# EAGLE design siggen (EAGLE 5.10)
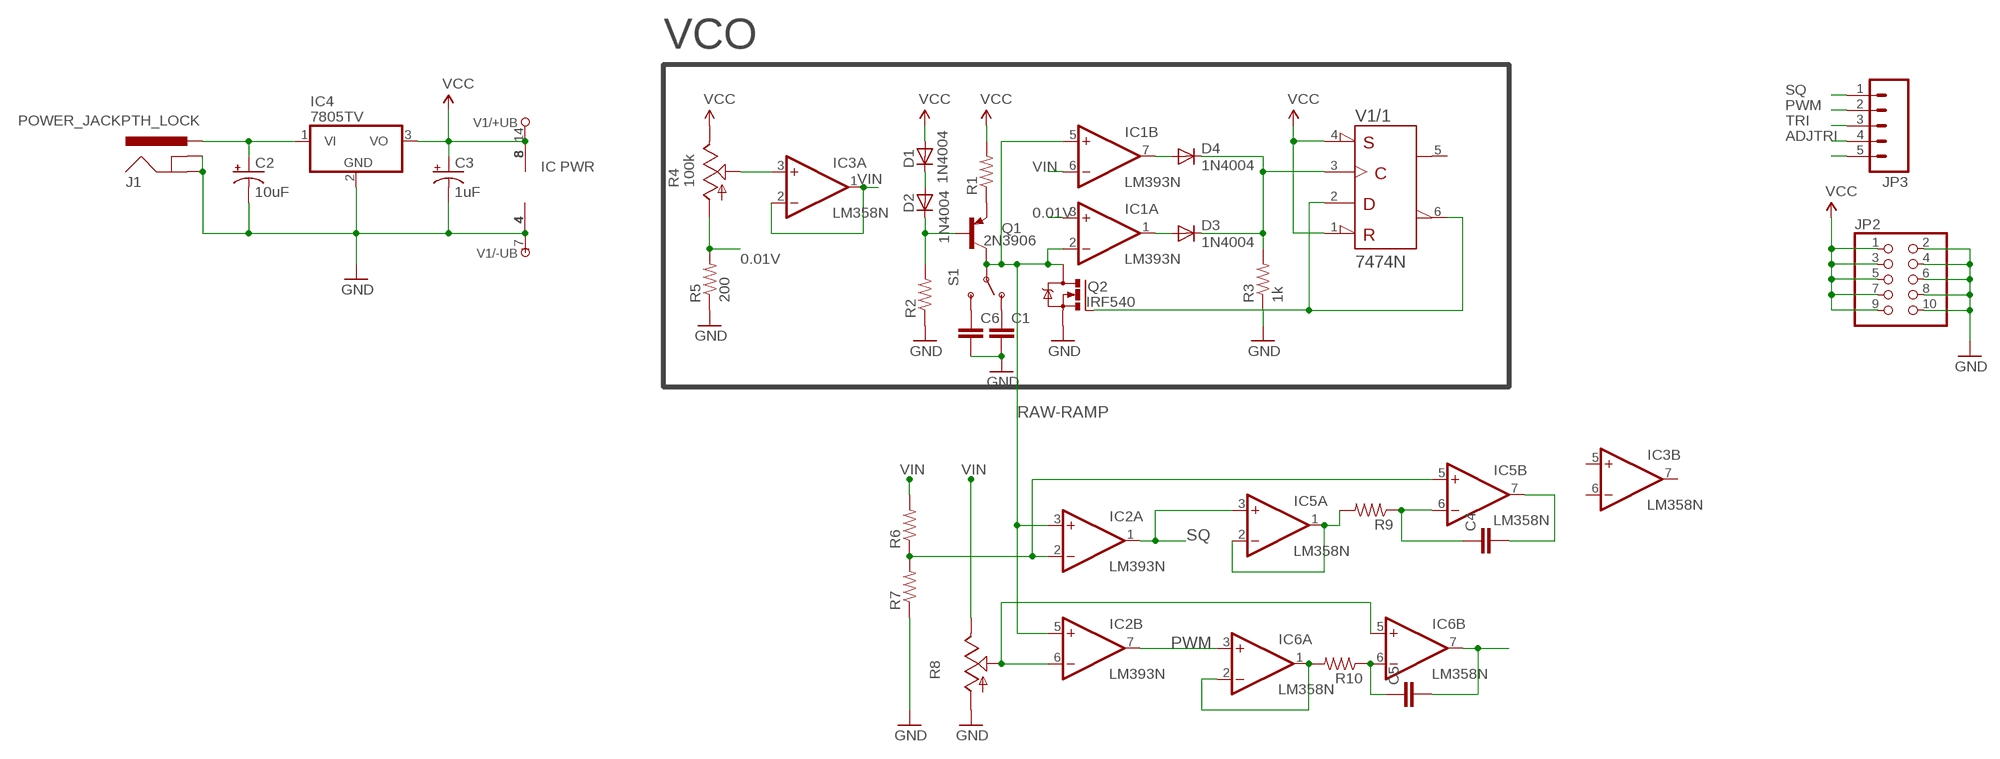
[diagram p0: schematic, sheet 1]

## Parts
C1  C5/3  [C5B3]
C2  10uF  CAP_POLPTH2  [CPOL-RADIAL-10UF-25V]
C3  1uF  CAP_POLPTH2  [CPOL-RADIAL-10UF-25V]
C4  C5/3  [C5B3]
C5  C5/3  [C5B3]
C6  C5/3  [C5B3]
D1  1N4004  [DO41-10]
D2  1N4004  [DO41-10]
D3  1N4004  [DO41-10]
D4  1N4004  [DO41-10]
IC1  LM393N  [DIL08]
IC2  LM393N  [DIL08]
IC3  LM358N  [DIL08]
IC4  7805TV  [TO220V]
IC5  LM358N  [DIL08]
IC6  LM358N  [DIL08]
J1  POWER_JACKPTH_LOCK  [POWER_JACK_PTH_LOCK]
JP2  PINHD-2X5  [2X05]
JP3  M05PTH  [1X05]
Q1  2N3906  [TO92]
Q2  IRF540  [TO220BV]
R1  R-US_0207/7  [0207/7]
R2  R-US_0207/7  [0207/7]
R3  1k  R-US_0207/7  [0207/7]
R4  100k  TRIM_US-B25V  [B25V]
R5  200  R-US_0207/7  [0207/7]
R6  R-US_0207/7  [0207/7]
R7  R-US_0207/7  [0207/7]
R8  TRIM_US-B25V  [B25V]
R9  R-US_0207/7  [0207/7]
R10  R-US_0207/7  [0207/7]
S1  SWITCH-SPSTPTH  [SWITCH-SPDT]
V1  7474N  [DIL14]

## Nets
0.01V: IC1.3(A:+IN) R4.A R5.2
ADJTRI: C5.2 IC6.7(B:OUT) JP3.4
GND: C1.2 C2.2(-) C3.2(-) C6.2 IC1.4(P:V-) IC2.4(P:V-) IC3.4(P:V-) IC4.2(GND) IC5.4(P:V-) IC6.4(P:V-) J1.GND J1.GNDBREAK JP2.2 JP2.4 JP2.6 JP2.8 JP2.10 Q2.S R2.1 R3.1 R5.1 R7.1 R8.A V1.7(/-UB:-UB)
N$1: D1.C D2.A
N$2: D2.C Q1.2(B) R2.2
N$3: Q1.3(E) R1.1
N$4: IC2.2(A:-IN) IC5.5(B:+IN) R6.1 R7.2
N$5: D4.A IC1.7(B:OUT)
N$6: D3.A IC1.1(A:OUT)
N$7: D3.C D4.C R3.2 V1.3(/1:CLK)
N$8: IC3.3(A:+IN) R4.S
N$9: C2.1(+) IC4.1(VI) J1.PWR
N$10: IC2.6(B:-IN) IC6.5(B:+IN) R8.S
N$11: Q2.G V1.2(/1:D) V1.6(/1:!Q)
N$12: C4.1 IC5.6(B:-IN) R9.1
N$14: IC5.1(A:OUT) IC5.2(A:-IN) R9.2
N$15: IC6.1(A:OUT) IC6.2(A:-IN) R10.2
N$16: C5.1 IC6.6(B:-IN) R10.1
N$17: C6.1 S1.3(S)
N$18: C1.1 S1.1(O)
N$21: JP3.5
PWM: IC2.7(B:OUT) IC6.3(A:+IN) JP3.2
RAW-RAMP: IC1.2(A:-IN) IC1.5(B:+IN) IC2.3(A:+IN) IC2.5(B:+IN) Q1.1(C) Q2.D S1.2(P)
SQ: IC2.1(A:OUT) IC5.3(A:+IN) JP3.1
TRI: C4.2 IC5.7(B:OUT) JP3.3
VCC: C3.1(+) D1.A IC1.8(P:V+) IC2.8(P:V+) IC3.8(P:V+) IC4.3(VO) IC5.8(P:V+) IC6.8(P:V+) JP2.1 JP2.3 JP2.5 JP2.7 JP2.9 R1.2 R4.E V1.1(/1:!CLR) V1.4(/1:!PRE) V1.14(/+UB:+UB)
VIN: IC1.6(B:-IN) IC3.1(A:OUT) IC3.2(A:-IN) R6.2 R8.E
Unconnected: IC3.5(B:+IN) IC3.6(B:-IN) IC3.7(B:OUT) V1.5(/1:Q) V1.8(/2:!Q) V1.9(/2:Q) V1.10(/2:!PRE) V1.11(/2:CLK) V1.12(/2:D) V1.13(/2:!CLR)

## Notes on the sheet
- VCO
- IC PWR

## Library data of the parts
C1 C4-C6 = capacitor-wima:C: CAPACITOR naming: grid - package width
C2 C3 = SparkFun:CAP_POL: Capacitor Polarized These are standard SMD and PTH capacitors. Normally 10uF, 47uF, and 100uF in electrolytic and tantalum varieties. Always verify the external diameter of the through hole cap, it varies with capacity, voltage, and manufacturer. The EIA devices should be standard.
D1-D4 = diode:1N4004: DIODE general purpose rectifier, 1 A
IC1 IC2 = linear:LM393: COMPARATOR
IC3 IC5 IC6 = linear:LM358: OP AMP also LM158; LM258; LM2904 Source: http://cache.national.com/ds/LM/LM158.pdf
IC4 = linear:78*: Positive VOLTAGE REGULATOR Source: http://cache.national.com/ds/LM/LM78L05.pdf http://www.fairchildsemi.com/ds/LM/LM7805.pdf
J1 = SparkFun:POWER_JACK: Power Jack This is the standard 5.5mm barrel jack for power. The PTH is the most common, proven, reliable, footprint. All others are experimental. The Slot footprint only works if the mill layer is transmitted to the PCB fab house so be warned. Spark Fun Electronics SKU : PRT-00119. Mating wall wart : TOL-00298 (and others)
JP2 = pinhead:PINHD-2X5: PIN HEADER
JP3 = SparkFun:M05: Header 5 Standard 5-pin 0.1" header. Use with straight break away headers (SKU : PRT-00116), right angle break away headers (PRT-00553), swiss pins (PRT-00743), machine pins (PRT-00117), and female headers (PRT-00115). Molex polarized connector foot print use with SKU : PRT-08230 with associated crimp pins and housings.
Q1 = transistor-pnp:2N3906: PNP Transistor
Q2 = transistor-power:IRF540: HEXFET Power MOSFET
R1-R3 R5-R7 R9 R10 = rcl:R-US_: RESISTOR, American symbol
R4 R8 = pot:TRIM_US-: POTENTIOMETER
S1 = SparkFun:SWITCH-SPST: SPST Switch Simple slide switch. Spark Fun Electronics SKU : COM-00102
V1 = 74ttl-din:74*74: Dual D type positive edge triggered FLIP FLOP, preset and clear

## Board
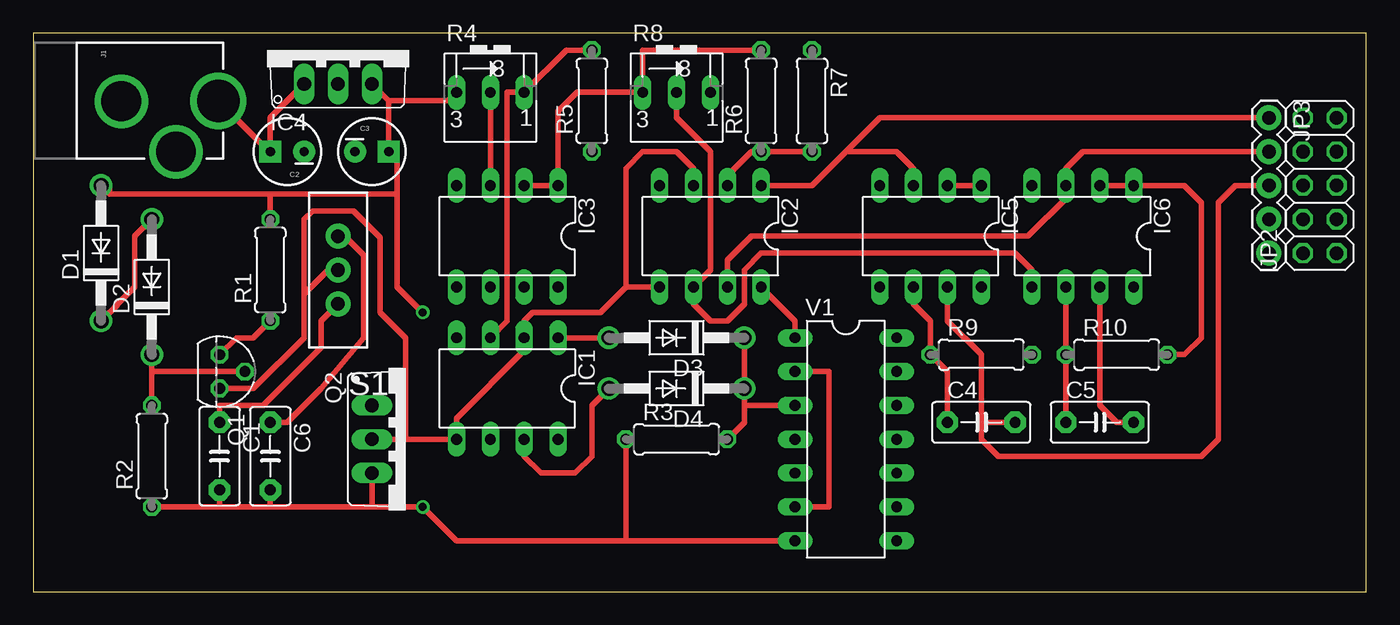
[diagram p1: board, top side]
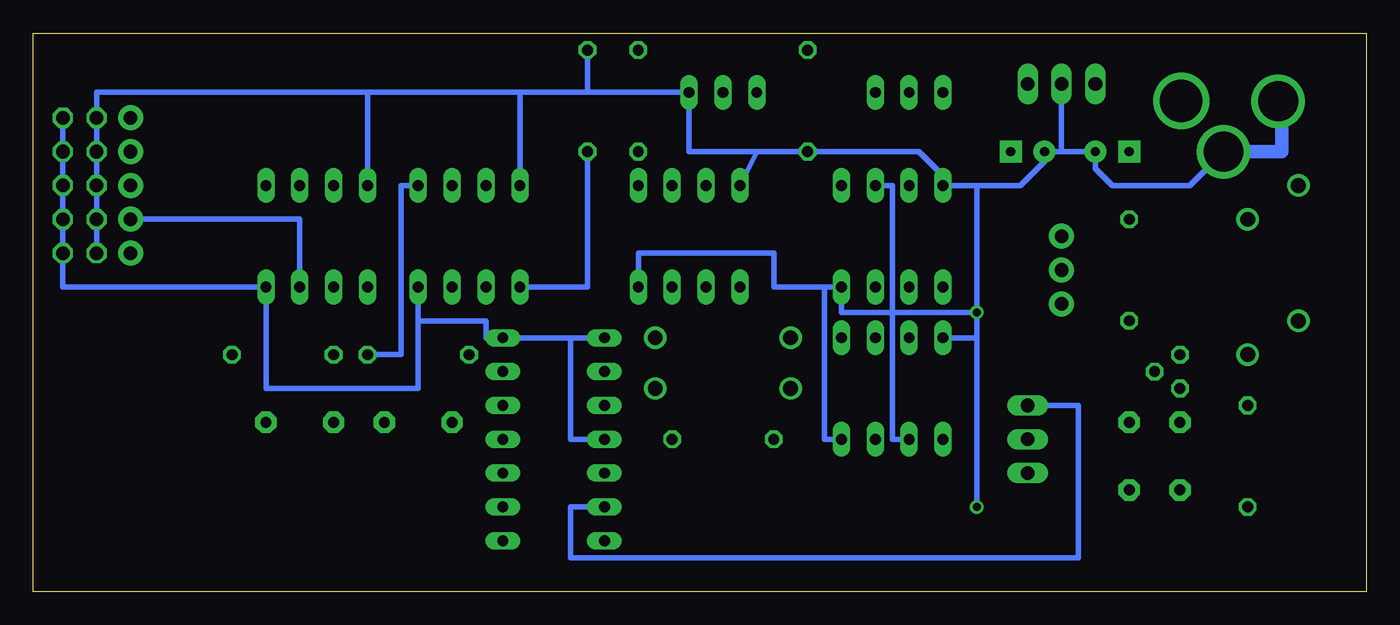
[diagram p2: board, bottom side, seen from below]

Size 100 x 41.9 mm. Coordinates in mm from the lower left corner, seen from the top.
Outline: 0,0 100,0 100,41.9 0,41.9 0,0
Copper layers (1*16): Top 0.035mm / dielectric 1.5mm / Bottom 0.035mm
Design rules "default": minimum track width 10mil, minimum drill 24mil, track to track 8mil, track to pad 8mil, pad to pad 8mil, via to via 8mil, smd to smd 8mil, copper to edge 40mil, drill to drill 8mil, minimum pad ring 10mil, minimum via ring 8mil, stop-mask expansion 4mil, vias tented up to drill 0mil, thermal gap 10mil

### Footprints (pad centres in the part's own frame; a part is rotated, then mirrored left to right if it is on the bottom)
C5B3 = drill 0.813 pad 1.6 octagon: 1 -2.54,0; 2 2.54,0
CPOL-RADIAL-10UF-25V = drill 0.7 pad 1.651 square: 1 1.27,0 | drill 0.7 pad 1.651 round: 2 -1.27,0
DO41-10 = drill 1.118 round: A 5.08,0; C -5.08,0
DIL08 = drill 0.813 pad 1.27 long: 1 -3.81,-3.81; 2 -1.27,-3.81; 3 1.27,-3.81; 4 3.81,-3.81; 5 3.81,3.81; 6 1.27,3.81; 7 -1.27,3.81; 8 -3.81,3.81
TO220V = drill 1.016 long: 1 -2.54,-2.54; 2 0,-2.54; 3 2.54,-2.54
POWER_JACK_PTH_LOCK = drill 2.997 round: GND 0.025,6.608; GNDBREAK 3.812,10.7 | drill 3.2 round: PWR 0,13.878
2X05 = drill 1.016 octagon: 1 -5.08,-1.27; 2 -5.08,1.27; 3 -2.54,-1.27; 4 -2.54,1.27; 5 0,-1.27; 6 0,1.27; 7 2.54,-1.27; 8 2.54,1.27; 9 5.08,-1.27; 10 5.08,1.27
1X05 = drill 1.016 pad 1.88 round: 1 0,0; 2 2.54,0; 3 5.08,0; 4 7.62,0; 5 10.16,0
TO92 = drill 0.813 octagon: 1 1.27,0; 2 0,1.905; 3 -1.27,0
TO220BV = drill 1.016 long: D 0,-2.54; G -2.54,-2.54; S 2.54,-2.54
0207/7 = drill 0.813 octagon: 1 -3.81,0; 2 3.81,0
B25V = drill 0.813 long: A 2.54,0.635; E -2.54,0.635; S 0,0.635
SWITCH-SPDT = drill 1.016 pad 1.88 round: 1 0,2.54; 2 0,0; 3 0,-2.54
DIL14 = drill 0.813 long: 1 -7.62,-3.81; 2 -5.08,-3.81; 3 -2.54,-3.81; 4 0,-3.81; 5 2.54,-3.81; 6 5.08,-3.81; 7 7.62,-3.81; 8 7.62,3.81; 9 5.08,3.81; 10 2.54,3.81; 11 0,3.81; 12 -2.54,3.81; 13 -5.08,3.81; 14 -7.62,3.81

### Placement (x,y rotation side)
C1  13.97,10.16 270 top
C2  19.05,33.02 180 top
C3  25.4,33.02 0 top
C4  71.12,12.7 0 top
C5  80.01,12.7 0 top
C6  17.78,10.16 270 top
D1  5.08,25.4 90 top
D2  8.89,22.86 90 top
D3  48.26,19.05 180 top
D4  48.26,15.24 180 top
IC1  35.56,15.24 180 top
IC2  50.8,26.67 180 top
IC3  35.56,26.67 180 top
IC4  22.86,40.64 0 top
IC5  67.31,26.67 180 top
IC6  78.74,26.67 180 top
J1  0,36.83 270 top
JP2  96.52,30.48 90 top
JP3  92.71,35.56 270 top
Q1  13.97,16.51 270 top
Q2  27.94,11.43 270 top
R1  17.78,24.13 90 top
R2  8.89,10.16 90 top
R3  48.26,11.43 0 top
R4  34.29,36.83 0 top
R5  41.91,36.83 90 top
R6  54.61,36.83 90 top
R7  58.42,36.83 270 top
R8  48.26,36.83 0 top
R9  71.12,17.78 0 top
R10  81.28,17.78 0 top
S1  22.86,24.13 180 top
V1  60.96,11.43 270 top

### Tracks (layer width: path | path; a pad name or v marks a point on that pad's centre or on a via)
0.01V
  Top 0.406: R5.2 40.01,40.64 R4.A 35.56,37.47 35.56,20.32 IC1.3
ADJTRI
  Top 0.406: C5.2 81.28,12.7 80.01,13.97 IC6.7
  Bottom 0.406: JP3.4 80.01,27.94 IC6.7
GND  (via drill 0.6)
  Top 0.406: 25.4,6.35 v29.21,6.35 31.75,3.81 44.45,3.81 | R2.1 13.97,6.35 | 13.97,6.35 C1.2 | 13.97,6.35 17.78,6.35 | 17.78,6.35 25.4,6.35 | 25.4,6.35 Q2.S | 44.45,3.81 V1.7 | 44.45,3.81 R3.1 | 17.78,6.35 C6.2
  Bottom 0.406: 22.86,33.02 C2.2 20.32,31.75 19.05,30.48 13.24,30.48 J1.GNDBREAK | 22.86,33.02 C3.2 24.13,32.28 25.93,30.48 IC3.4 | 22.86,33.02 IC4.2 | IC3.4 31.75,31.22 33.55,33.02 R5.1 45.72,33.02 | 45.72,33.02 IC2.4 | 45.72,33.02 50.8,33.02 R8.A 58.42,37.47 | 58.42,37.47 R7.1 | IC3.4 29.21,30.48 29.21,19.05 | 29.21,19.05 IC1.4 | v29.21,6.35 29.21,19.05 | 58.42,37.47 63.5,37.47 | 63.5,37.47 IC5.4 | 63.5,37.47 74.93,37.47 | 74.93,37.47 IC6.4 | 74.93,37.47 95.25,37.47 JP2.10 JP2.8 JP2.6 JP2.4 JP2.2
  Bottom 1.016: J1.GND 6.35,36.8 6.35,33.02 J1.GNDBREAK
N$1
  Top 0.406: D1.C 7.62,22.86 7.62,26.67 D2.A
N$2
  Top 0.406: R2.2 8.89,16.51 | 8.89,16.51 D2.C | 8.89,16.51 Q1.2
N$3
  Top 0.406: Q1.3 15.24,19.05 16.51,19.05 R1.1
N$4
  Top 0.406: R7.2 R6.1 53.87,33.02 52.07,31.22 IC2.2
  Bottom 0.406: IC5.5 58.42,22.86 R7.2
N$5
  Top 0.406: D4.A 41.91,13.97 41.91,10.16 40.64,8.89 38.1,8.89 36.83,10.16 IC1.7
N$6
  Top 0.406: IC1.1 D3.A
N$7
  Top 0.406: D3.C D4.C 53.34,13.97 | R3.2 53.34,12.7 53.34,13.97 | 53.34,13.97 V1.3
N$8
  Top 0.406: IC3.3 R4.S
N$9
  Top 0.406: J1.PWR 17.69,33.02 C2.1 17.78,35.56 IC4.1
N$10
  Top 0.406: R8.S 48.26,35.56 50.8,33.02 50.8,24.13 IC2.6 49.53,21.59 50.8,20.32 52.07,20.32 53.34,21.59 53.34,24.13 54.61,25.4 73.66,25.4 74.93,24.13 IC6.5
N$11
  Top 0.406: V1.6 59.69,6.35 59.69,16.51 V1.2
  Bottom 0.406: Q2.G 21.59,13.97 21.59,2.54 59.69,2.54 59.69,6.35 V1.6
N$12
  Top 0.406: C4.1 68.58,16.51 R9.1 67.31,20.32 66.04,21.59 IC5.6
N$14
  Top 0.406: IC5.1 IC5.2
  Bottom 0.406: R9.2 72.39,17.78 72.39,30.48 IC5.1
N$15
  Top 0.406: IC6.2 IC6.1 86.36,30.48 87.63,29.21 87.63,19.05 86.36,17.78 R10.2
N$16
  Top 0.406: C5.1 R10.1 IC6.6
N$17
  Top 0.406: S1.3 23.34,26.67 24.77,25.25 24.77,19.05 21.59,15.24 19.05,12.7 C6.1
N$18
  Top 0.406: S1.1 21.59,20.32 21.59,18.31 17.25,13.97 13.97,13.97 C1.1
PWM
  Top 0.406: IC2.7 52.07,24.87 53.87,26.67 74.63,26.67 77.47,29.51 IC6.3 77.47,31.75 78.74,33.02 JP3.2
RAW-RAMP
  Top 0.406: IC2.3 49.53,31.75 48.26,33.02 45.72,33.02 44.45,31.75 44.45,22.86 | 44.45,22.86 IC2.5 | 44.45,22.86 42.55,20.95 37.47,20.95 36.83,20.32 IC1.2 36.83,18.08 31.75,13 IC1.5 Q2.D 27.94,11.43 27.94,19.05 26.04,20.95 26.04,26.57 24.03,28.57 20.95,28.57 20.32,27.94 20.32,22.33 | Q1.1 16.51,15.24 20.32,19.05 20.32,22.33 | 20.32,22.33 22.12,24.13 S1.2
SQ
  Top 0.406: 60.96,33.02 64.77,33.02 66.04,31.75 IC5.3 | IC2.1 58.42,30.48 60.96,33.02 | 60.96,33.02 63.5,35.56 JP3.1
TRI
  Top 0.406: 71.12,12.7 C4.2 | 71.12,12.7 71.12,17.78 68.58,20.32 IC5.7 | JP3.3 90.17,30.48 88.9,29.21 88.9,11.43 87.63,10.16 72.39,10.16 71.12,11.43 71.12,12.7
VCC  (via drill 0.6)
  Top 0.406: 26.67,36.83 IC4.3 | 26.67,36.83 C3.1 27.3,33.02 27.3,29.84 | R4.E 31.11,36.83 26.67,36.83 | 17.78,29.84 27.3,29.84 | 17.52,28.2 R1.2 17.78,29.84 | IC2.8 57.15,20.32 V1.1 | 27.3,29.84 27.3,22.86 v29.21,20.95 | D1.A 5.71,30.48 5.71,29.84 17.78,29.84
  Bottom 0.406: V1.4 59.69,11.43 59.69,19.05 | V1.1 59.69,19.05 | IC1.8 40.64,11.43 40.64,22.86 IC3.8 | IC3.8 44.45,22.86 44.45,25.4 54.61,25.4 IC2.8 | 59.69,19.05 V1.14 66.04,19.05 66.04,20.32 71.12,20.32 | IC3.8 39.37,20.95 v29.21,20.95 | 71.12,20.32 IC5.8 | 71.12,20.32 71.12,15.24 82.55,15.24 IC6.8 97.79,22.86 JP2.1 JP2.3 JP2.5 JP2.7 JP2.9
VIN
  Top 0.406: IC3.2 IC3.1 39.37,36.05 40.79,37.47 R8.E 45.72,40.64 R6.2
  Bottom 0.406: IC1.6 35.56,11.43 35.56,30.48 IC3.2